# Altium schematic sheet OpAmp.SchDoc
size A3; Author: Thomas Kreppel; CompanyName: TU München; DrawnBy: Thomas Kreppel; Engineer: Eyke Liegmann; Organization: TUM EAL; Address1: Arcisstraße 21; Address2: 80333 München; Address3: GERMANY; SheetNumber: 3; SheetTotal: 6; CompanyName2: EAL
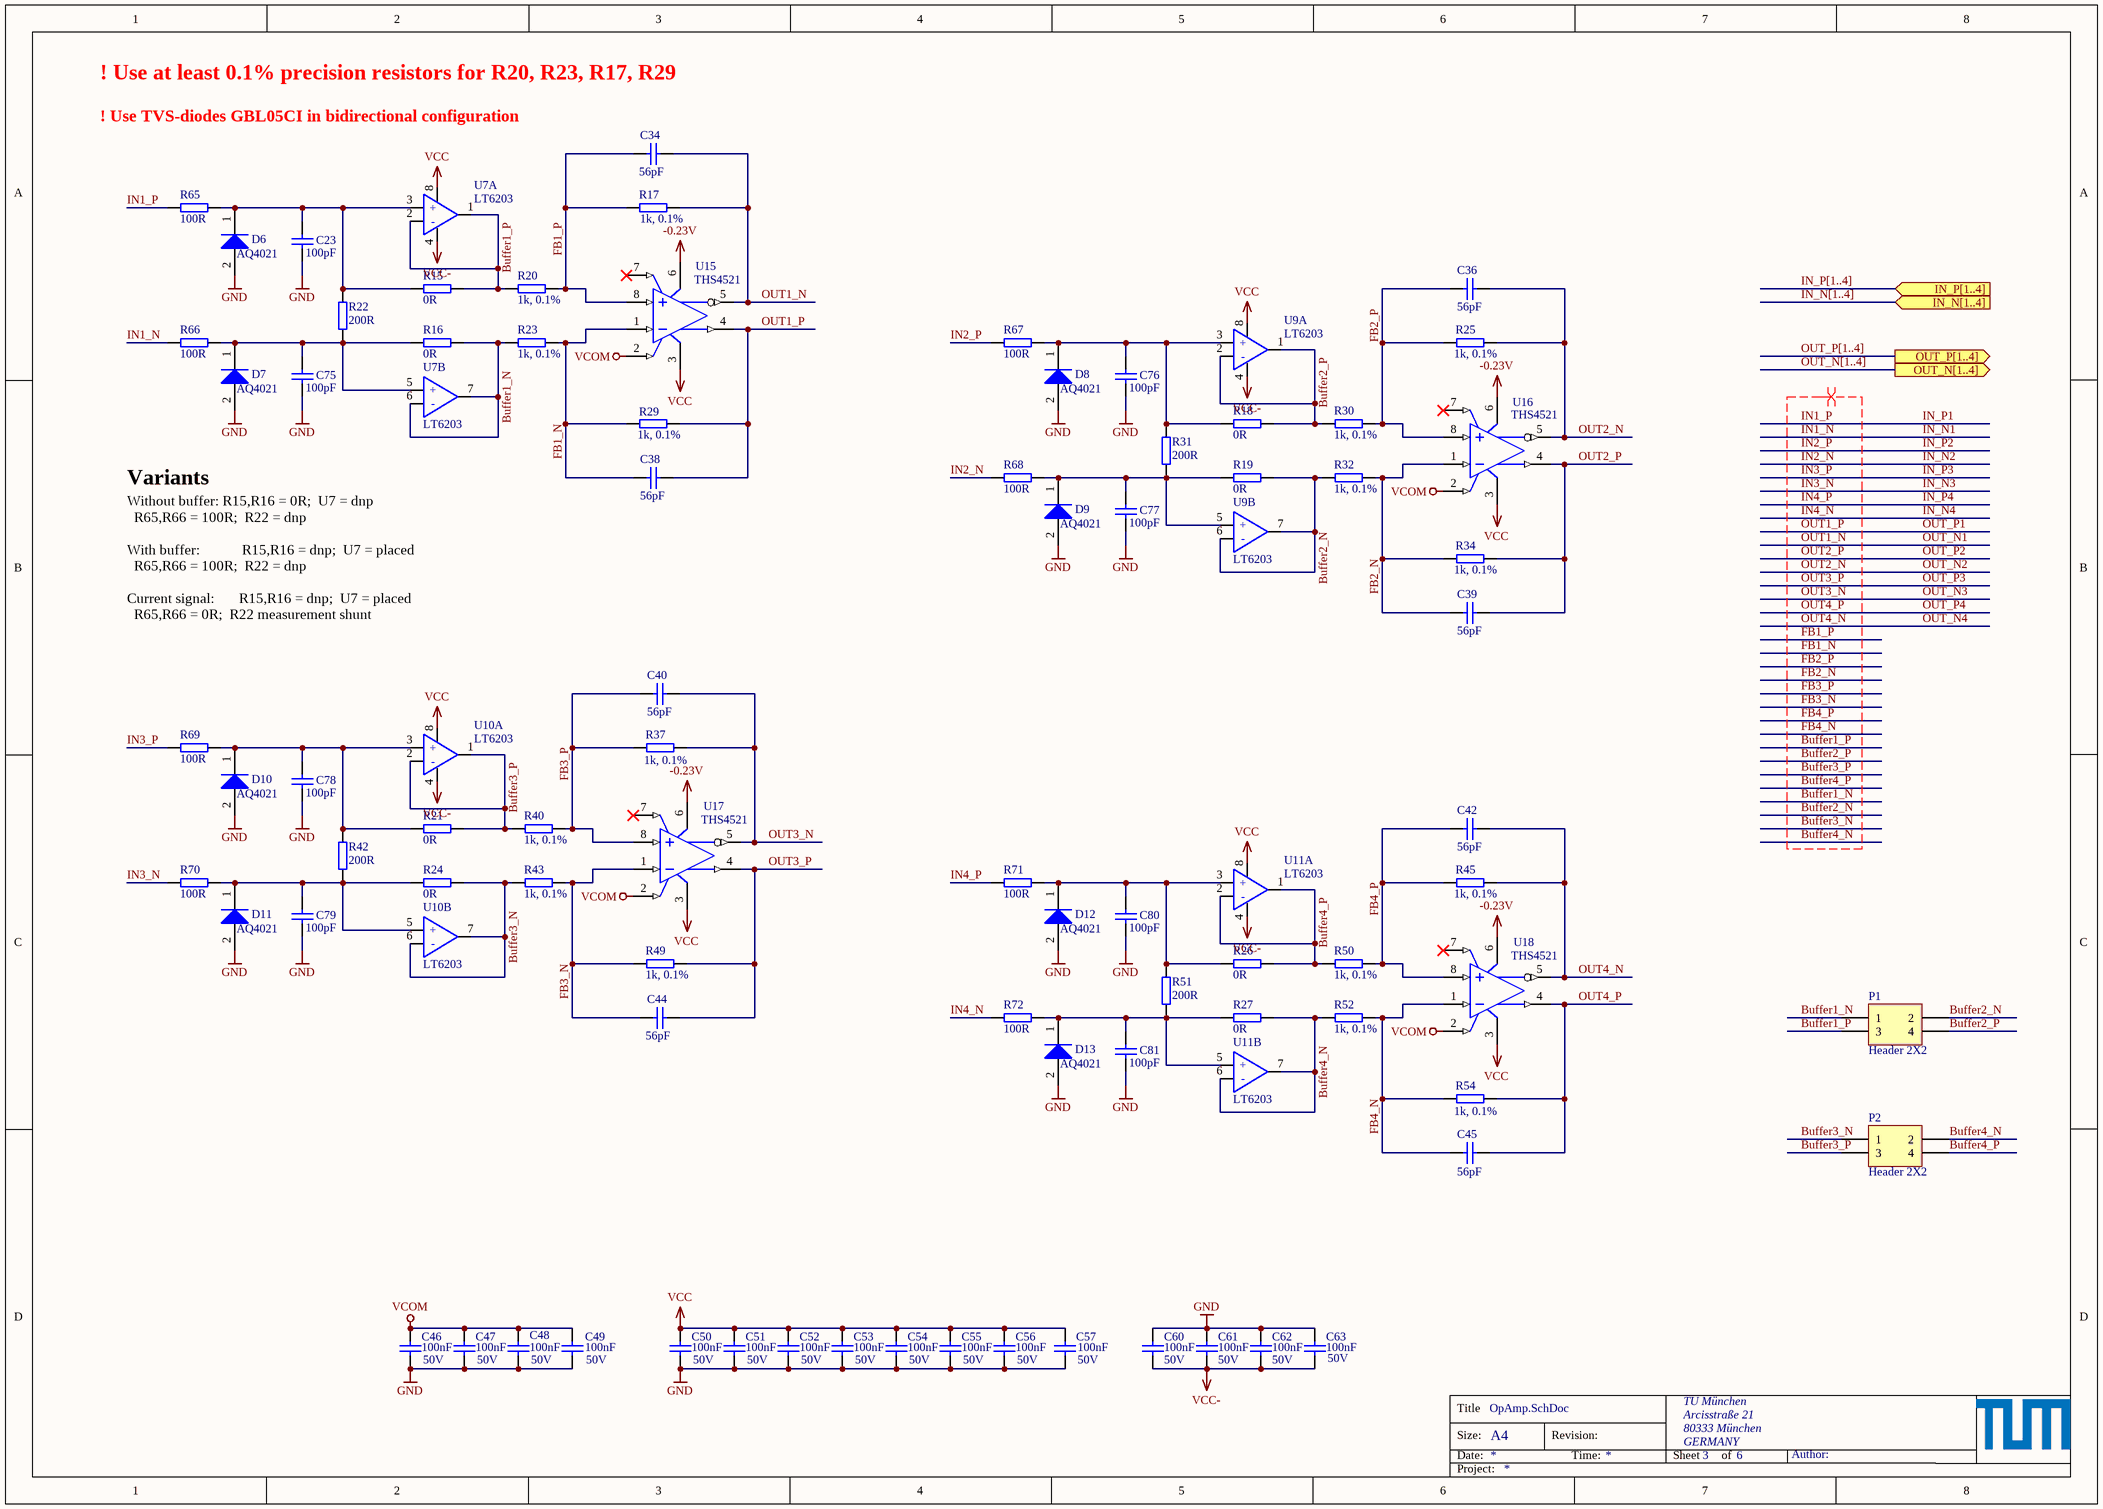
[diagram p0: OpAmp.SchDoc]

## Parts
C23  100pF  [CAPC1608X07N]
C34  56pF  [CAPC1608X07N]
C36  56pF  [CAPC1608X07N]
C38  56pF  [CAPC1608X07N]
C39  56pF  [CAPC1608X07N]
C40  56pF  [CAPC1608X07N]
C42  56pF  [CAPC1608X07N]
C44  56pF  [CAPC1608X07N]
C45  56pF  [CAPC1608X07N]
C46  100nF  Voltage: 50V  [CAPC1608X07N]
C47  100nF  Voltage: 50V  [CAPC1608X07N]
C48  100nF  Voltage: 50V  [CAPC1608X07N]
C49  100nF  Voltage: 50V  [CAPC1608X07N]
C50  100nF  Voltage: 50V  [CAPC1608X07N]
C51  100nF  Voltage: 50V  [CAPC1608X07N]
C52  100nF  Voltage: 50V  [CAPC1608X07N]
C53  100nF  Voltage: 50V  [CAPC1608X07N]
C54  100nF  Voltage: 50V  [CAPC1608X07N]
C55  100nF  Voltage: 50V  [CAPC1608X07N]
C56  100nF  Voltage: 50V  [CAPC1608X07N]
C57  100nF  Voltage: 50V  [CAPC1608X07N]
C60  100nF  Voltage: 50V  [CAPC1608X07N]
C61  100nF  Voltage: 50V  [CAPC1608X07N]
C62  100nF  Voltage: 50V  [CAPC1608X07N]
C63  100nF  Voltage: 50V  [CAPC1608X07N]
C75  100pF  [CAPC1608X07N]
C76  100pF  [CAPC1608X07N]
C77  100pF  [CAPC1608X07N]
C78  100pF  [CAPC1608X07N]
C79  100pF  [CAPC1608X07N]
C80  100pF  [CAPC1608X07N]
C81  100pF  [CAPC1608X07N]
D6  AQ4021  [SOD-323_SuppressorDiode]
D7  AQ4021  [SOD-323_SuppressorDiode]
D8  AQ4021  [SOD-323_SuppressorDiode]
D9  AQ4021  [SOD-323_SuppressorDiode]
D10  AQ4021  [SOD-323_SuppressorDiode]
D11  AQ4021  [SOD-323_SuppressorDiode]
D12  AQ4021  [SOD-323_SuppressorDiode]
D13  AQ4021  [SOD-323_SuppressorDiode]
P1  Header 2X2  [HDR2X2]  (no BOM)
P2  Header 2X2  [HDR2X2]  (no BOM)
R15  0R  [RESC1608X06N]
R16  0R  [RESC1608X06N]
R17  1k, 0.1%  [RESC1608X06N]
R18  0R  [RESC1608X06N]
R19  0R  [RESC1608X06N]
R20  1k, 0.1%  [RESC1608X06N]
R21  0R  [RESC1608X06N]
R22  200R  [RESC3216X65N]
R23  1k, 0.1%  [RESC1608X06N]
R24  0R  [RESC1608X06N]
R25  1k, 0.1%  [RESC1608X06N]
R26  0R  [RESC1608X06N]
R27  0R  [RESC1608X06N]
R29  1k, 0.1%  [RESC1608X06N]
R30  1k, 0.1%  [RESC1608X06N]
R31  200R  [RESC3216X65N]
R32  1k, 0.1%  [RESC1608X06N]
R34  1k, 0.1%  [RESC1608X06N]
R37  1k, 0.1%  [RESC1608X06N]
R40  1k, 0.1%  [RESC1608X06N]
R42  200R  [RESC3216X65N]
R43  1k, 0.1%  [RESC1608X06N]
R45  1k, 0.1%  [RESC1608X06N]
R49  1k, 0.1%  [RESC1608X06N]
R50  1k, 0.1%  [RESC1608X06N]
R51  200R  [RESC3216X65N]
R52  1k, 0.1%  [RESC1608X06N]
R54  1k, 0.1%  [RESC1608X06N]
R65  100R  [RESC1608X06N]
R66  100R  [RESC1608X06N]
R67  100R  [RESC1608X06N]
R68  100R  [RESC1608X06N]
R69  100R  [RESC1608X06N]
R70  100R  [RESC1608X06N]
R71  100R  [RESC1608X06N]
R72  100R  [RESC1608X06N]
U7  LT6203  [MSOP8_3x3-8N]  (parts A,B of 2)
U9  LT6203  [MSOP8_3x3-8N]  (parts A,B of 2)
U10  LT6203  [MSOP8_3x3-8N]  (parts A,B of 2)
U11  LT6203  [MSOP8_3x3-8N]  (parts A,B of 2)
U15  THS4521  [DGK0008A_N]
U16  THS4521  [DGK0008A_N]
U17  THS4521  [DGK0008A_N]
U18  THS4521  [DGK0008A_N]

## Ports
IN_N[1..4] (in), IN_P[1..4] (in), OUT_N[1..4] (out), OUT_P[1..4] (out)

## Nets
-0.23V: U15.6(VS-) U16.6(VS-) U17.6(VS-) U18.6(VS-)
GND: C23.2 C46.2 C47.2 C48.2 C49.2 C50.2 C51.2 C52.2 C53.2 C54.2 C55.2 C56.2 C57.2 C60.1 C61.1 C62.1 C63.1 C75.2 C76.2 C77.2 C78.2 C79.2 C80.2 C81.2 D6.2(A) D7.2(A) D8.2(A) D9.2(A) D10.2(A) D11.2(A) D12.2(A) D13.2(A)
VCC: C50.1 C51.1 C52.1 C53.1 C54.1 C55.1 C56.1 C57.1 U7.8 U9.8 U10.8 U11.8 U15.3(VS+) U16.3(VS+) U17.3(VS+) U18.3(VS+)
VCC-: C60.2 C61.2 C62.2 C63.2 U7.4 U9.4 U10.4 U11.4
VCOM: C46.1 C47.1 C48.1 C49.1 U15.2(VOCM) U16.2(VOCM) U17.2(VOCM) U18.2(VOCM)
Buffer1_N: P1.1 R16.2 R23.2 U7.6(-) U7.7
Buffer1_P: P1.3 R15.2 R20.1 U7.1 U7.2(-)
Buffer2_N: P1.2 R19.2 R32.2 U9.6(-) U9.7
Buffer2_P: P1.4 R18.2 R30.1 U9.1 U9.2(-)
Buffer3_N: P2.1 R24.2 R43.2 U10.6(-) U10.7
Buffer3_P: P2.3 R21.2 R40.1 U10.1 U10.2(-)
Buffer4_N: P2.2 R27.2 R52.2 U11.6(-) U11.7
Buffer4_P: P2.4 R26.2 R50.1 U11.1 U11.2(-)
FB1_N: C38.1 R23.1 R29.1 U15.1(VIN-)
FB1_P: C34.1 R17.1 R20.2 U15.8(VIN+)
FB2_N: C39.1 R32.1 R34.1 U16.1(VIN-)
FB2_P: C36.1 R25.1 R30.2 U16.8(VIN+)
FB3_N: C44.1 R43.1 R49.1 U17.1(VIN-)
FB3_P: C40.1 R37.1 R40.2 U17.8(VIN+)
FB4_N: C45.1 R52.1 R54.1 U18.1(VIN-)
FB4_P: C42.1 R45.1 R50.2 U18.8(VIN+)
IN1_N: R66.1  [also labelled IN_N1]
IN1_P: R65.1  [also labelled IN_P1]
IN2_N: R68.1  [also labelled IN_N2]
IN2_P: R67.1  [also labelled IN_P2]
IN3_N: R70.1  [also labelled IN_N3]
IN3_P: R69.1  [also labelled IN_P3]
IN4_N: R72.1  [also labelled IN_N4]
IN4_P: R71.1  [also labelled IN_P4]
OUT1_N: C34.2 R17.2 U15.5(VOUT-)  [also labelled OUT_N1]
OUT1_P: C38.2 R29.2 U15.4(VOUT+)  [also labelled OUT_P1]
OUT2_N: C36.2 R25.2 U16.5(VOUT-)  [also labelled OUT_N2]
OUT2_P: C39.2 R34.2 U16.4(VOUT+)  [also labelled OUT_P2]
OUT3_N: C40.2 R37.2 U17.5(VOUT-)  [also labelled OUT_N3]
OUT3_P: C44.2 R49.2 U17.4(VOUT+)  [also labelled OUT_P3]
OUT4_N: C42.2 R45.2 U18.5(VOUT-)  [also labelled OUT_N4]
OUT4_P: C45.2 R54.2 U18.4(VOUT+)  [also labelled OUT_P4]
NetC23_1: C23.1 D6.1(K) R15.1 R22.2 R65.2 U7.3(+)
NetC75_1: C75.1 D7.1(K) R16.1 R22.1 R66.2 U7.5(+)
NetC76_1: C76.1 D8.1(K) R18.1 R31.2 R67.2 U9.3(+)
NetC77_1: C77.1 D9.1(K) R19.1 R31.1 R68.2 U9.5(+)
NetC78_1: C78.1 D10.1(K) R21.1 R42.2 R69.2 U10.3(+)
NetC79_1: C79.1 D11.1(K) R24.1 R42.1 R70.2 U10.5(+)
NetC80_1: C80.1 D12.1(K) R26.1 R51.2 R71.2 U11.3(+)
NetC81_1: C81.1 D13.1(K) R27.1 R51.1 R72.2 U11.5(+)

Not connected (* = marked no-connect by the designer): U15 7(~{PD})*; U16 7(~{PD})*; U17 7(~{PD})*; U18 7(~{PD})*

## Buses and harness runs
bus IN_N[1..4] = port IN_N[1..4]
bus IN_P[1..4] = port IN_P[1..4]
bus OUT_N[1..4] = port OUT_N[1..4]
bus OUT_P[1..4] = port OUT_P[1..4]

## Layout directives
differential pair: Buffer1_N, Buffer1_P, Buffer2_N, Buffer2_P, Buffer3_N, Buffer3_P, Buffer4_N, Buffer4_P, FB1_N, FB1_P, FB2_N, FB2_P, FB3_N, FB3_P, FB4_N, FB4_P, IN1_N, IN1_P, IN2_N, IN2_P, IN3_N, IN3_P, IN4_N, IN4_P, OUT1_N, OUT1_P, OUT2_N, OUT2_P, OUT3_N, OUT3_P, OUT4_N, OUT4_P

## Notes on the sheet
- ! Use at least 0.1% precision resistors for R20, R23, R17, R29
- ! Use TVS-diodes GBL05CI in bidirectional configuration
- Variants
- Without buffer:	R15,R16 = 0R; 	U7 = dnp
  R65,R66 = 100R; 	R22 = dnp
  With buffer:           	R15,R16 = dnp; 	U7 = placed
  R65,R66 = 100R; 	R22 = dnp
  Current signal:      	R15,R16 = dnp; 	U7 = placed
  R65,R66 = 0R; 	R22 measurement shunt
- Title
- Size:
- Date:
- A4
- Revision:
- Time:
- Sheet
- of
- Author:
- Project:

## Library data of the parts
C23 C75-C81 = Cap_0603: MPN: 885012006057; MF: Würth Elektronik; Voltage: 50V; Value: 100pF; Supplier 1: Mouser; Supplier 2: *; Supplier Part Number 1: 710-885012006057; Supplier Part Number 2: *; Package: 0603
C34 C36 C38-C40 C42 C44 C45 = Cap_0603: MPN: VJ0603A560JXACW1BC; MF: Vishay; Voltage: 50V; Dielectric: C0G; Value: 56pF; Supplier 1: Mouser; Supplier 2: *; Supplier Part Number 1: 77-VJ0603A560JXACBC; Supplier Part Number 2: *; Package: 0603
C46-C57 C60-C63 = Cap_0603: MPN: CC0603KRX7R9BB104; MF: Yageo; Dielectric: X5R; Value: 100nF; Supplier 1: Mouser; Supplier 2: Mouser; Supplier Part Number 1: 603-CC603KRX7R9BB104; Supplier Part Number 2: 710-885382206004; Package: 0603
D6-D13 = GBLCxx: ESD Suppressor Diode TVS Bi-Dir 5V; MPN: AQ4021-01FTG-C; MF: Littelfuse; Reverse Standoff Voltage: 5.0V; Breakdown Voltage: 6.3V; Package: SOD-323; Supplier 1: Mouser; Supplier 2: Digi-Key; Supplier Part Number 1: 576-AQ4021-01FTG-C; Supplier Part Number 2: F10397CT-ND; ComponentLink1Description: Datasheet; Supplier 3: Farnell; Supplier Part Number 3: 2834965; Model: AQ4021
  D6 D8-D13: ComponentLink1URL: https://static6.arrow.com/aropdfconversion/cf1b73a38d87e210bfa153441e03466b149f09ba/gblci.pdf
  D7: ComponentLink1URL: https://www.littelfuse.com/~/media/electronics/datasheets/tvs_diode_arrays/littelfuse_tvs_diode_array_aq4021_datasheet.pdf.pdf?src-supplier=Digi-Key
P1 P2 = Header 2X2: Header, 2-Pin, Dual row; LatestRevisionDate: 17-Jul-2002; LatestRevisionNote: Re-released for DXP Platform.; Publisher: Altium Limited
R15 R16 R18 R19 R21 R24 R26 R27 = R_0603: MPN: CRCW06030000Z0EBC; MF: Vishay / Dale; Value: 0R; Supplier 1: Mouser; Supplier Part Number 1: 71-CRCW06030000Z0EBC; Package: 0603
R17 R20 R23 R25 R29 R30 R32 R34 R37 R40 R43 R45 R49 R50 R52 R54 = R_0603: Precision Resistor 1k 0.1% 0603; MPN: PCF-W0603LF-03-1001-B-P-LT; MF: IRC/TT Electronics; Precision: 0,1%; Value: 1k, 0.1%; Supplier 1: Mouser; Supplier Part Number 1: 66-PCFW0603LF031001B; Package: 0603; Supplier 2: RSComponents; Supplier Part Number 2: 178-6613; Supplier 3: RSComponents; Supplier Part Number 3: 520-3620
R22 R31 R42 R51 = R_1206: WID SMD 1M 5% 0,25W; MPN: APC1206B200RN; AN: 22757; Mixed: SMT; Preferred: Yes; MF: AECOL/Ohmite; Case: 1206; Value: 200R; Technology: TK100; Created: 2018_07_20_AGeiger; Tolerance: 5%; Supplier 1: Mouser; Supplier Part Number 1: 284-APC1206B200RN
R65-R72 = R_0603: MPN: AC0603FR-13100RL; MF: Yageo; Tolerance: 1%; Value: 100R; Supplier 1: Mouser; Supplier Part Number 1: 603-AC0603FR-13100RL; Package: 0603
U7 U9-U11 = LT6203_MSOP8: 2 Ch Low Noise, Low Power OpAmp; MPN: LT6203CMS8#PBF; MF: Linear Technology; Created: Kreppel_20190830; Package: MSOP-8; Supplier 1: Mouser; Supplier Part Number 1: 584-LT6203CMS8#PBF; ComponentLink1Description: Manufacturer; ComponentLink1URL: https://www.analog.com/en/index.html; ComponentLink2Description: Datasheet; ComponentLink2URL: https://www.analog.com/media/en/technical-documentation/data-sheets/620234fd.pdf
U15-U18 = THS4521IDGKR: IC AMP RRO NEG OUT VLP 8VSSOP (Single Channel fully differential Amplifier); Manufacturer: Texas Instruments; Min Dual Supply Voltage: 1.5V; Max Dual Supply Voltage: 2.75V; Number of Channels: 1; Voltage Gain: 119dB; Slew Rate: 490V/µs; Max I/O Voltage: 2mV; Max Supply Voltage: 5.5V; Min Supply Voltage: 2.5V; Unity Gain Bandwidth Product: 95MHz; Common Mode Rejection Ratio: 80dB; Operating Supply Voltage: 5V; Bandwidth: 145MHz; Nominal Supply Current: 1.14mA; Input Bias Current: 900nA; Output Current per Channel: 55mA; Supplier 1: Mouser; Manufacturer Part Number: THS4521IDGKR; RoHS: Yes; Category: Amplifiers - Op Amps, Buffer, Instrumentation; Stock 1: 12114; Pricing 1: 1=2,55000, 10=2,29000, 25=2,16000, 100=1,78000, 250=1,59000, 500=1,54000, 1000=1,28000, 2500=1,25000, 1=2,83000, 10=2,54000, 25=2,40000, 100=1,98000, 250=1,77000, 500=1,71000 (EUR); Case/Package: VSSOP; Number of Pins: 8; Weight: 0.000935oz; Min Operating Temperature: -40°C; Max Operating Temperature: 85°C; Packaging: Tape and Reel; Package Quantity: 2500; -3db Bandwidth: 145MHz; Gain Bandwidth Product: 95MHz; Input Offset Voltage (Vos): 2mV; Operating Supply Current: 1.14mA; Power Supply Rejection Ratio (PSRR): 80dB; Number of Circuits: 1; Number of Elements: 1; Number of Amplifiers: 1; Radiation Hardening: No; Lead Free: Lead Free; REACH SVHC: No SVHC; ComponentLink1URL: https://datasheet.ciiva.com/14456/sbos458f-14456592.pdf?src-supplier=Avnet; ComponentLink1Description: old Datasheet; ComponentLink2URL: https://datasheet.ciiva.com/18622/ths4521-18622155.pdf?src-supplier=Digi-Key; ComponentLink2Description: Datasheet; ComponentLink3URL: https://www.ti.com/; ComponentLink3Description: Manufacturer; Supplier Part Number 1: 595-THS4521IDGKR